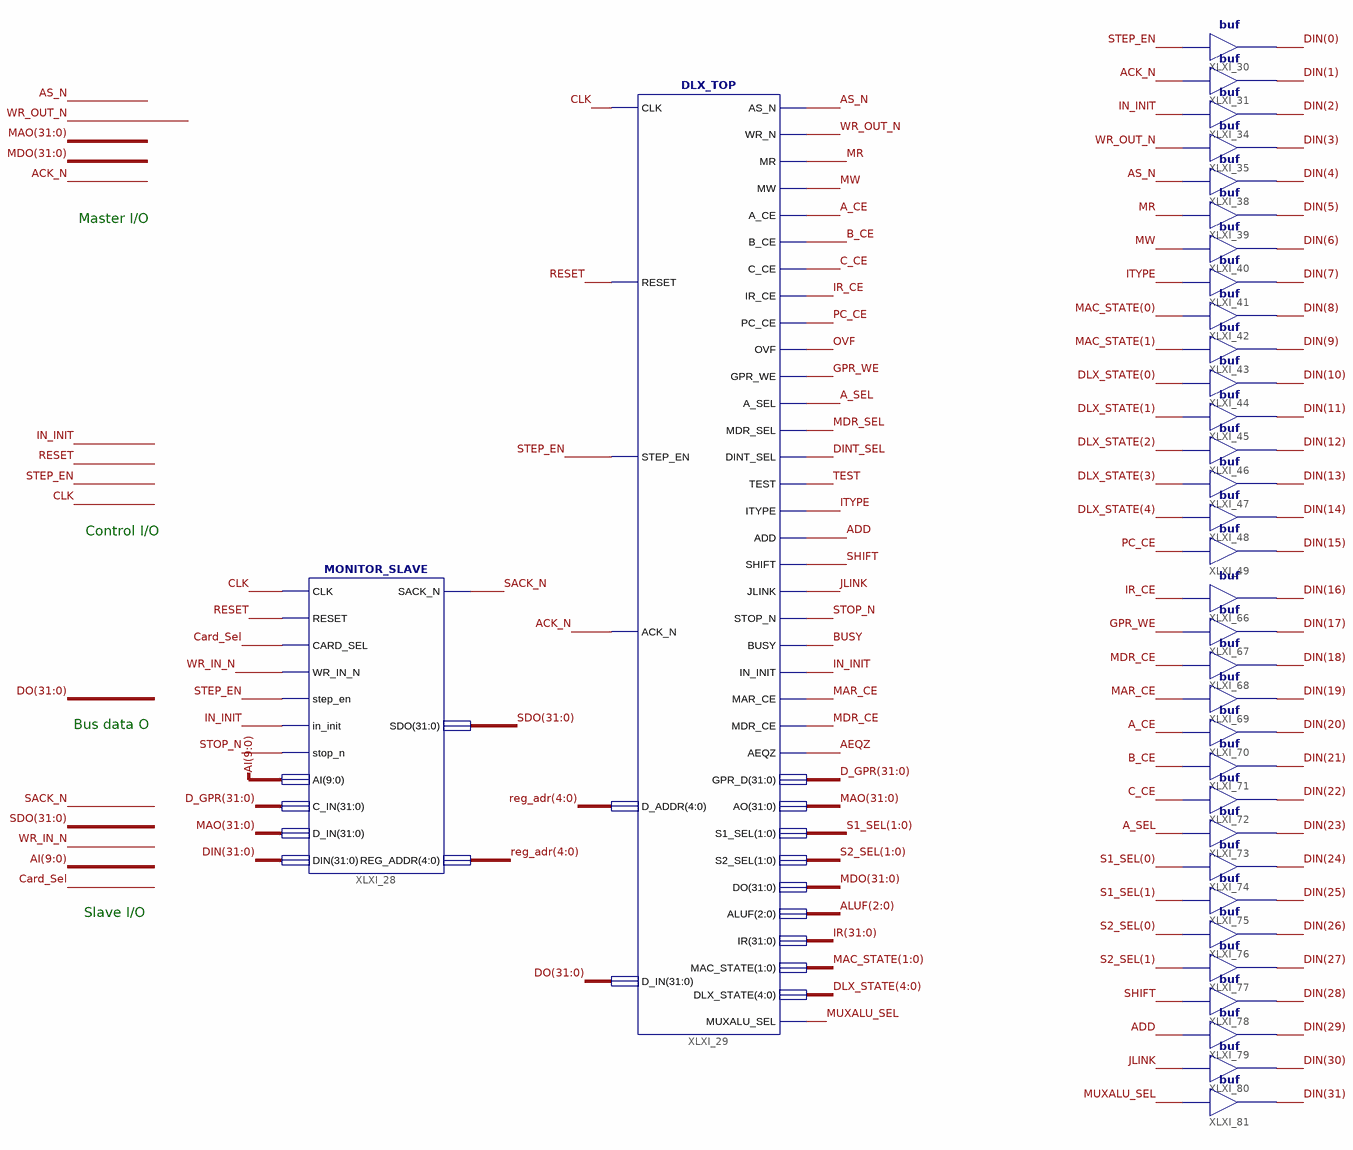
[diagram p0: schematic sheet 1]
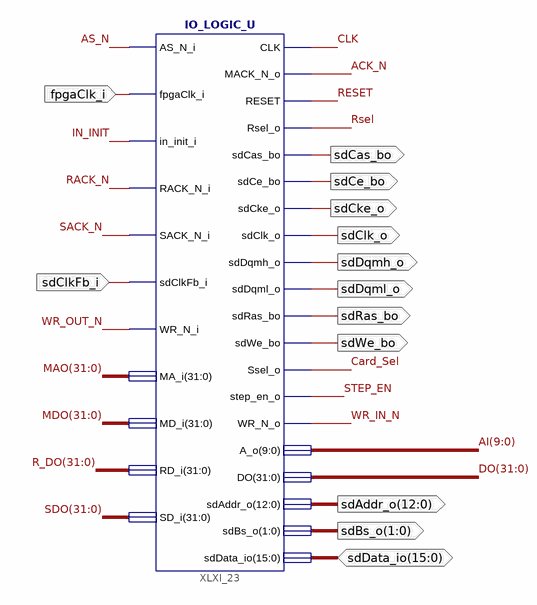
[diagram p1: schematic sheet 2]
// Xilinx ISE schematic Top_Level.sch (spartan6) as structural Verilog: 35 symbols, 13 ports
module Top_Level (
  input  fpgaClk_i,
  input  sdClkFb_i,
  inout  [15:0] sdData_io,
  output sdClk_o,
  output [1:0] sdBs_o,
  output sdDqml_o,
  output sdDqmh_o,
  output sdWe_bo,
  output sdCas_bo,
  output sdRas_bo,
  output sdCe_bo,
  output sdCke_o,
  output [12:0] sdAddr_o
);

  wire A_CE, A_SEL, ACK_N, ADD, AEQZ, AS_N, B_CE, BUSY, C_CE, Card_Sel, CLK, DINT_SEL, GPR_WE, IN_INIT,
       IR_CE, ITYPE, JLINK, MAR_CE, MDR_CE, MDR_SEL, MR, MUXALU_SEL, MW, OVF, PC_CE, RACK_N, RESET, Rsel,
       SACK_N, SHIFT, STEP_EN, STOP_N, TEST, WR_IN_N, WR_OUT_N;
  wire [1:0] MAC_STATE, S1_SEL, S2_SEL;
  wire [2:0] ALUF;
  wire [4:0] DLX_STATE, reg_adr;
  wire [9:0] AI;
  wire [31:0] D_GPR, DIN, DO, IR, MAO, MDO, R_DO, SDO;

  IO_LOGIC_U XLXI_23 (
    .AS_N_i(AS_N), .fpgaClk_i(fpgaClk_i), .in_init_i(IN_INIT), .RACK_N_i(RACK_N), .SACK_N_i(SACK_N),
    .sdClkFb_i(sdClkFb_i), .WR_N_i(WR_OUT_N), .MA_i(MAO), .MD_i(MDO), .RD_i(R_DO), .SD_i(SDO), .CLK(CLK),
    .MACK_N_o(ACK_N), .RESET(RESET), .Rsel_o(Rsel), .sdCas_bo(sdCas_bo), .sdCe_bo(sdCe_bo),
    .sdCke_o(sdCke_o), .sdClk_o(sdClk_o), .sdDqmh_o(sdDqmh_o), .sdDqml_o(sdDqml_o), .sdRas_bo(sdRas_bo),
    .sdWe_bo(sdWe_bo), .Ssel_o(Card_Sel), .step_en_o(STEP_EN), .WR_N_o(WR_IN_N), .A_o(AI), .DO(DO),
    .sdAddr_o(sdAddr_o), .sdBs_o(sdBs_o), .sdData_io(sdData_io));
  MONITOR_SLAVE XLXI_28 (
    .CLK(CLK), .RESET(RESET), .CARD_SEL(Card_Sel), .WR_IN_N(WR_IN_N), .step_en(STEP_EN), .in_init(IN_INIT),
    .stop_n(STOP_N), .AI(AI), .C_IN(D_GPR), .D_IN(MAO), .DIN(DIN), .SACK_N(SACK_N), .SDO(SDO),
    .REG_ADDR(reg_adr));
  DLX_TOP XLXI_29 (
    .CLK(CLK), .RESET(RESET), .STEP_EN(STEP_EN), .ACK_N(ACK_N), .D_ADDR(reg_adr), .D_IN(DO), .AS_N(AS_N),
    .WR_N(WR_OUT_N), .MR(MR), .MW(MW), .A_CE(A_CE), .B_CE(B_CE), .C_CE(C_CE), .IR_CE(IR_CE), .PC_CE(PC_CE),
    .OVF(OVF), .GPR_WE(GPR_WE), .A_SEL(A_SEL), .MDR_SEL(MDR_SEL), .DINT_SEL(DINT_SEL), .TEST(TEST),
    .ITYPE(ITYPE), .ADD(ADD), .SHIFT(SHIFT), .JLINK(JLINK), .STOP_N(STOP_N), .BUSY(BUSY), .IN_INIT(IN_INIT),
    .MAR_CE(MAR_CE), .MDR_CE(MDR_CE), .AEQZ(AEQZ), .GPR_D(D_GPR), .AO(MAO), .S1_SEL(S1_SEL), .S2_SEL(S2_SEL),
    .DO(MDO), .ALUF(ALUF), .IR(IR), .MAC_STATE(MAC_STATE), .DLX_STATE(DLX_STATE), .MUXALU_SEL(MUXALU_SEL));
  buf XLXI_30 (DIN[0], STEP_EN);
  buf XLXI_31 (DIN[1], ACK_N);
  buf XLXI_34 (DIN[2], IN_INIT);
  buf XLXI_35 (DIN[3], WR_OUT_N);
  buf XLXI_38 (DIN[4], AS_N);
  buf XLXI_39 (DIN[5], MR);
  buf XLXI_40 (DIN[6], MW);
  buf XLXI_41 (DIN[7], ITYPE);
  buf XLXI_42 (DIN[8], MAC_STATE[0]);
  buf XLXI_43 (DIN[9], MAC_STATE[1]);
  buf XLXI_44 (DIN[10], DLX_STATE[0]);
  buf XLXI_45 (DIN[11], DLX_STATE[1]);
  buf XLXI_46 (DIN[12], DLX_STATE[2]);
  buf XLXI_47 (DIN[13], DLX_STATE[3]);
  buf XLXI_48 (DIN[14], DLX_STATE[4]);
  buf XLXI_49 (DIN[15], PC_CE);
  buf XLXI_66 (DIN[16], IR_CE);
  buf XLXI_67 (DIN[17], GPR_WE);
  buf XLXI_68 (DIN[18], MDR_CE);
  buf XLXI_69 (DIN[19], MAR_CE);
  buf XLXI_70 (DIN[20], A_CE);
  buf XLXI_71 (DIN[21], B_CE);
  buf XLXI_72 (DIN[22], C_CE);
  buf XLXI_73 (DIN[23], A_SEL);
  buf XLXI_74 (DIN[24], S1_SEL[0]);
  buf XLXI_75 (DIN[25], S1_SEL[1]);
  buf XLXI_76 (DIN[26], S2_SEL[0]);
  buf XLXI_77 (DIN[27], S2_SEL[1]);
  buf XLXI_78 (DIN[28], SHIFT);
  buf XLXI_79 (DIN[29], ADD);
  buf XLXI_80 (DIN[30], JLINK);
  buf XLXI_81 (DIN[31], MUXALU_SEL);

  // Notes on the sheet:
  //   Master I/O
  //   Control I/O
  //   Bus data O
  //   Slave I/O
endmodule
